# Altium schematic sheet SCHEMATICO segunda.SchDoc
size 247 x 113 mm
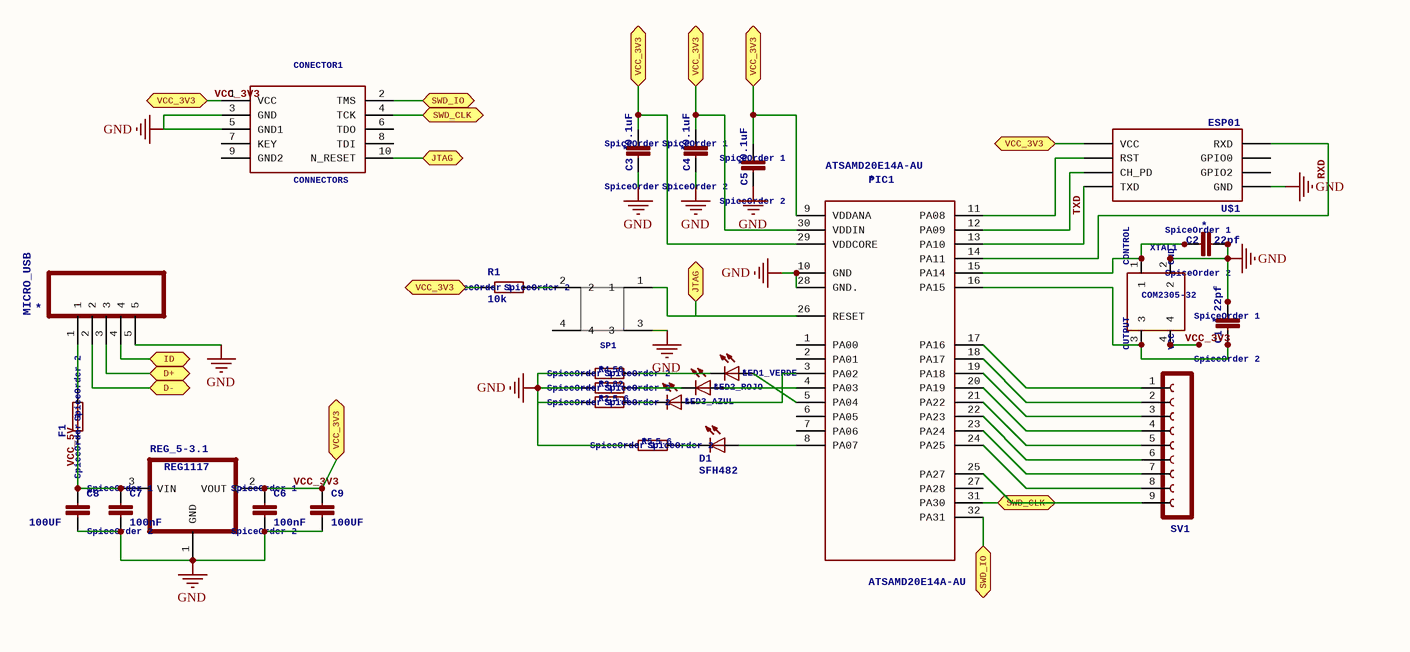
[diagram p0: SCHEMATICO segunda.SchDoc]

## Parts
C1  22pf  SpiceOrder1: SpiceOrder 1  SpiceOrder2: SpiceOrder 2  [C0603]
C2  22pf  SpiceOrder1: SpiceOrder 1  SpiceOrder2: SpiceOrder 2  [C0603]
C3  0.1uF  SpiceOrder1: SpiceOrder 1  SpiceOrder2: SpiceOrder 2  [C0603]
C4  0.1uF  SpiceOrder1: SpiceOrder 1  SpiceOrder2: SpiceOrder 2  [C0603]
C5  0.1uF  SpiceOrder1: SpiceOrder 1  SpiceOrder2: SpiceOrder 2  [C0603]
C6  100nF  SpiceOrder1: SpiceOrder 1  SpiceOrder2: SpiceOrder 2  [C0603]
C7  100nF  SpiceOrder1: SpiceOrder 1  SpiceOrder2: SpiceOrder 2  [C0603]
C8  100UF  [C0603]
C9  100UF  [C0603]
CONECTOR1  CONNECTORS  [CONNECTORS]
D1  SFH482  [SFH482]
F1  SpiceOrder1: SpiceOrder 1  SpiceOrder2: SpiceOrder 2  [R0603]  (hidden comment: R-EU_R0603)
LED1_VERDE  LEDCHIPLED_1206  [CHIPLED_1206]  (value not drawn)
LED2_ROJO  LEDCHIPLED_1206  [CHIPLED_1206]  (value not drawn)
LED3_AZUL  LEDCHIPLED_1206  [CHIPLED_1206]  (value not drawn)
MICRO_USB  47346-0001  [MOLEX_47346-0001]  (value not drawn)
PIC1  ATSAMD20E14A-AU  [QFP80P900X900X120-32N]
R1  10k  SpiceOrder1: SpiceOrder 1  SpiceOrder2: SpiceOrder 2  [R0603]
R2  5.6  SpiceOrder1: SpiceOrder 1  SpiceOrder2: SpiceOrder 2  [R0603]
R3  82  SpiceOrder1: SpiceOrder 1  SpiceOrder2: SpiceOrder 2  [R0603]
R4  56  SpiceOrder1: SpiceOrder 1  SpiceOrder2: SpiceOrder 2  [R0603]
R5  5.6  SpiceOrder1: SpiceOrder 1  SpiceOrder2: SpiceOrder 2  [R0603]
REG_5-3.1  REG1117  [SOT223]
SP1  PULSADOR  [PULSADOR]  (value not drawn)
SV1  FE09-1  [FE09]  (value not drawn)
U$1  ESP01  [ESP01]
XTAL1  XTAL  [XTAL16MM2]  (value not drawn)

## Ports
D+, D-, ID, JTAG, SWD_CLK, SWD_IO, VCC_3V3

## Nets
GND: C1.2 C2.2 C3.1 C4.1 C5.1 C6.2 C7.2 C8.2 C9.2 CONECTOR1.3(GND) CONECTOR1.5(GND1) MICRO_USB.5 PIC1.10(GND) PIC1.28(GND.) R2.1 R3.1 R4.1 R5.1 REG_5-3.1.1(GND) SP1.3 U$1.GND XTAL1.2
D+: MICRO_USB.3 ; port D+
D-: MICRO_USB.2 ; port D-
ID: MICRO_USB.4 ; port ID
JTAG: CONECTOR1.10(N_RESET) PIC1.26(RESET) SP1.1 ; port JTAG
RXD: PIC1.14(PA11) U$1.RX(RXD)
SWD_CLK: CONECTOR1.4(TCK) PIC1.25(PA27) PIC1.31(PA30) SV1.9 ; port SWD_CLK
SWD_IO: CONECTOR1.2(TMS) PIC1.32(PA31) ; port SWD_IO
TXD: PIC1.13(PA10) U$1.TX(TXD)
VCC_3V3: C3.2 C4.2 C5.2 C6.1 C9.1 CONECTOR1.1(VCC) PIC1.9(VDDANA) PIC1.29(VDDCORE) PIC1.30(VDDIN) R1.1 REG_5-3.1.2(VOUT) U$1.VCC XTAL1.4 ; port VCC_3V3
VCC_5V: C7.1 C8.1 F1.1 REG_5-3.1.3(VIN)
NetC1_1: C1.1 PIC1.16(PA15) XTAL1.3
NetC2_1: C2.1 PIC1.15(PA14) XTAL1.1
NetD1_A: D1.A PIC1.8(PA07)
NetD1_K: D1.K(C) R5.2
NetF1_2: F1.2 MICRO_USB.1
NetLED1_VERDE_A: LED1_VERDE.A PIC1.5(PA04)
NetLED1_VERDE_C: LED1_VERDE.C R4.2
NetLED2_ROJO_A: LED2_ROJO.A PIC1.4(PA03)
NetLED2_ROJO_C: LED2_ROJO.C R3.2
NetLED3_AZUL_A: LED3_AZUL.A PIC1.3(PA02)
NetLED3_AZUL_C: LED3_AZUL.C R2.2
NetPIC1_11: PIC1.11(PA08) U$1.RST
NetPIC1_12: PIC1.12(PA09) U$1.CH_PD
NetPIC1_17: PIC1.17(PA16) SV1.1
NetPIC1_18: PIC1.18(PA17) SV1.2
NetPIC1_19: PIC1.19(PA18) SV1.3
NetPIC1_20: PIC1.20(PA19) SV1.4
NetPIC1_21: PIC1.21(PA22) SV1.5
NetPIC1_22: PIC1.22(PA23) SV1.6
NetPIC1_23: PIC1.23(PA24) SV1.7
NetPIC1_24: PIC1.24(PA25) SV1.8
NetR1_2: R1.2 SP1.2

Not connected (* = marked no-connect by the designer): CONECTOR1 6(TDO) 7(KEY) 8(TDI) 9(GND2); PIC1 1(PA00) 2(PA01) 6(PA05) 7(PA06) 27(PA28); SP1 4; U$1 GPIO0 GPIO2

## Library data of the parts
C1-C9 = C-EUC0603: CAPACITOR, European symbol; GateName_1: G$1; SymbolName_1: C-EU; DeviceName: C0603; DeviceSetName: C-EU
  C1 C2: LibraryName: resistor; NAME: *; SPICEPREFIX: C; WEBSITE_RS: http://es.rs-online.com/web/p/condensadores-ceramicos-multicapa/6982790/
  C3-C5: LibraryName: resistor; NAME: *; SPICEPREFIX: C; WEBSITE_RS: http://es.rs-online.com/web/p/condensadores-ceramicos-multicapa/2644630/
  C6 C7: LibraryName: resistor; SPICEPREFIX: C; WEBSITE_RS: http://es.rs-online.com/web/p/condensadores-ceramicos-multicapa/2644630/
  C8: LibraryName: rcl; NAME: *; WEBSITE_RS: http://es.rs-online.com/web/p/condensadores-de-aluminio/7270880/
  C9: LibraryName: rcl; WEBSITE_RS: http://es.rs-online.com/web/p/condensadores-de-aluminio/7270880/
CONECTOR1 = CONNECTORS: Conector macho para PCB HARWIN Recto 10 pines 2 filas paso 2.54mm, TerminaciÃ³n Soldada; GateName_1: G$1; SymbolName_1: CONNECTORS; LibraryName: connector; DeviceSetName: CONNECTORS; WEBSITE_RS: http://es.rs-online.com/web/p/conectores-macho-para-pcb/6812893/
D1 = SFH482: IR LEDinfrared emitting diode, Infineon; GateName_1: 1; SymbolName_1: LED; LibraryName: led; DeviceSetName: SFH482
F1 = R-EU_R0603: RESISTOR, European symbol; GateName_1: G$1; SymbolName_1: R-EU; DeviceSetName: R-EU_; CURRENT: 0.8A; DeviceName: R0603; LibraryName: fusible (2); FARNELL: 2291893; SPICEPREFIX: R
LED1_VERDE LED2_ROJO LED3_AZUL = LEDCHIPLED_1206: LEDOSRAM:- CHIPLEDLG R971, LG N971, LY N971, LG Q971, LY Q971, LO R971, LY R971 LH N974, LH R974LS Q976, LO Q976, LY Q976LO Q996- Hyper CHIPLEDLW Q18SLB Q993, LB Q99A, LB R99A- SideLEDLS A670, LO A670, LY A670, LG A670, LP A670LB A673, LV A673, LT A673, LW A673LH A674LY A675LS A676, LA A676, LO A676, LY A676, LW A676LS A679, LY A679, LG A679-  Hyper Micro SIDELEDÂ®LS Y876, LA Y876, LO Y876, LY Y876LT Y87S- SmartLEDLW L88C, LW L88SLB L89C, LB L89S, LG L890LS L89K, LO L89K, LY L89KLS L896, LA L896, LO L896, LY L896- TOPLEDLS T670, LO T670, LY T670, LG T670, LP T670LSG T670, LSP T670, LSY T670, LOP T670, LYG T670LG T671, LOG T671, LSG T671LB T673, LV T673, LT T673, LW T673LH T674LS T676, LA T676, LO T676, LY T676, LB T676, LH T676, LSB T676, LW T676LB T67C, LV T67C, LT T67C, LS T67K, LO T67K, LY T67K, LW E67CLS E67B, LA E67B, LO E67B, LY E67B, LB E67C, LV E67C, LT E67CLW T67CLS T679, LY T679, LG T679LS T770, LO T770, LY T770, LG T770, LP T770LB T773, LV T773, LT T773, LW T773LH T774LS E675, LA E675, LY E675, LS T675LS T776, LA T776, LO T776, LY T776, LB T776LHGB T686LT T68C, LB T68C- Hyper Mini TOPLEDÂ®LB M676- Mini TOPLED SantanaÂ®LG M470LS M47K, LO M47K, LY M47K Source: http://www.osram.convergy.deLUXEON:- LUMILEDÂ®LXK2-PW12-R00, LXK2-PW12-S00, LXK2-PW14-U00, LXK2-PW14-V00LXK2-PM12-R00, LXK2-PM12-S00, LXK2-PM14-U00LXK2-PE12-Q00, LXK2-PE12-R00, LXK2-PE12-S00, LXK2-PE14-T00, LXK2-PE14-U00LXK2-PB12-K00, LXK2-PB12-L00, LXK2-PB12-M00, LXK2-PB14-N00, LXK2-PB14-P00, LXK2-PB14-Q00LXK2-PR12-L00, LXK2-PR12-M00, LXK2-PR14-Q00, LXK2-PR14-R00LXK2-PD12-Q00, LXK2-PD12-R00, LXK2-PD12-S00LXK2-PH12-R00, LXK2-PH12-S00LXK2-PL12-P00, LXK2-PL12-Q00, LXK2-PL12-R00 Source: www.luxeon.comKINGBRIGHT:KA-3528ASYCSource: www.kingbright.com; GateName_1: G$1; SymbolName_1: LED; DeviceName: CHIPLED_1206; LibraryName: led; DeviceSetName: LED; NAME: *
  LED1_VERDE: WEBSITE_RS: http://es.rs-online.com/web/p/led-visibles/4663908/
  LED2_ROJO: WEBSITE_RS: http://es.rs-online.com/web/p/led-visibles/4663914/
  LED3_AZUL: WEBSITE_RS: http://es.rs-online.com/web/p/led-visibles/4663885/
MICRO_USB = 47346-0001: CONN RCPT 5POS MICRO USB R/A  SMD; GateName_1: G$1; SymbolName_1: 47346-0001; LibraryName: Molex-47346-0001; DeviceSetName: 47346-0001; MPN: 47346-0001; NAME: *; OC_FARNELL: 1568026; OC_NEWARK: 47M0505; PACKAGE: 5 POS MICRO USB R/A; SUPPLIER: MOLEX; WEBSITE_RS: http://es.rs-online.com/web/p/conectores-micro-usb/7025475/
PIC1 = ATSAMD20E14A-AU: Architecture:   ARM Cortex-M0+ CPU Speed:      48MHz Core Size:      32bit Embedded Interface Type:        I2C, SPI, UART, USART MCU Case Style:         TQFP MSL:    MSL 3 - 168 hours No. of I/O's:   26 No. of Pins:    32 Operating Temperature Max:      85Â°C Operating Temperature Min:      -40Â°C Packaging:      Each Peripherals:    ADC, Comparator, DAC, PWM, Timer Program Memory Size:    16KB Program Memory Size:    16KB RAM Memory Size:        2KB SVHC:   No SVHC (17-Dec-2014) Supply Voltage Max:     3.63V Supply Voltage Min:     1.62V; GateName_1: G$1; DESCRIPTION: 32-bit Microcontroller with In-System Programmable Flash; SymbolName_1: ATSAMD20E14A-AU; LibraryName: Atmel_By_element14_Batch_1-00; DeviceSetName: ATSAMD20E14A-AU; MPN: ATSAMD20E14A-AU; NAME: *; OC_FARNELL: 2363627; PACKAGE: TQFP-32; SUPPLIER: ATMEL; WEBSITE: http://www.atmel.com/devices/atsamd20e14.aspx; ATSAMD20E14A-AU: ATSAMD20E14A-AU
R1-R5 = R-EU_R0603: RESISTOR, European symbol; GateName_1: G$1; SymbolName_1: R-EU; DeviceSetName: R-EU_; DeviceName: R0603; LibraryName: resistor; SPICEPREFIX: R
  R1: WEBSITE_RS: http://es.rs-online.com/web/p/resistencias-fijas-para-montaje-en-superficie/7408805/
  R2 R5: NAME: *; WEBSITE_RS: http://es.rs-online.com/web/p/resistencias-fijas-para-montaje-en-superficie/7221144/
  R3: NAME: *; WEBSITE_RS: http://es.rs-online.com/web/p/resistencias-fijas-para-montaje-en-superficie/6790734/
  R4: NAME: *; WEBSITE_RS: http://es.rs-online.com/web/p/resistencias-fijas-para-montaje-en-superficie/6790550/
REG_5-3.1 = REG1117: 800mA and 1A Low Dropout (LDO) Positive Regulator1.8V, 2.5V, 2.85V, 3.3V, 5V, and Adj; GateName_1: G$1; SymbolName_1: REG1118; LibraryName: burr-brown; DeviceSetName: REG1117; MF: *; MPN: REG1117; OC_FARNELL: 1097566; OC_NEWARK: 14P6981; WEBSITE_RS: http://es.rs-online.com/web/p/reguladores-de-tenson-debaja-caida/6200852/
SP1 = PULSADOR: Interruptor tÃ¡ctil tipo BotÃ³n, Negro, contactos SPST-NA ON 1 - 3       2 - 4; GateName_1: G$1; IDENTIFY_RS: 479-1508; SymbolName_1: PULSADOR; LibraryName: Pulsador FSM4JSMA; DeviceSetName: PULSADOR; SUPPLIER: TE Connectivity; WEBSITE_RS: http://es.rs-online.com/web/p/interruptores-tactiles-resistivos/4791508/
SV1 = FE09-1: FEMALE HEADER; GateName_1: G$1; SymbolName_1: FE09-1; LibraryName: con-lsta; DeviceSetName: FE09-1; MF: *; MPN: *; OC_FARNELL: unknown; OC_NEWARK: unknown
U$1 = ESP01: ESP8266 Wifi module 01; GateName_1: G$1; SymbolName_1: ESP01; LibraryName: esp8266modules; DeviceSetName: ESP01
XTAL1 = XTAL: Oscilador de Cristal, 32 MHz, Â±50ppm HCMOS 15pF SMD, 4 pines, 5 x 3.2 x 1mm; GateName_1: G$1; IDENTIFY_RS: 707-9725; SymbolName_1: XTAL16MM2; LibraryName: xtal 5x3.2x1 RALTRON; DeviceSetName: XTAL; SUPPLIER: RALTRON; WEBSITE_RS: http://es.rs-online.com/web/p/osciladores-crystal/7079725/; CONTROL: CONTROL; GND: GND; VCC: VCC; OUTPUT: OUTPUT; COM2305-32: COM2305-32